# Altium schematic sheet FPGA_bank0_vss.SchDoc
size 420 x 297 mm
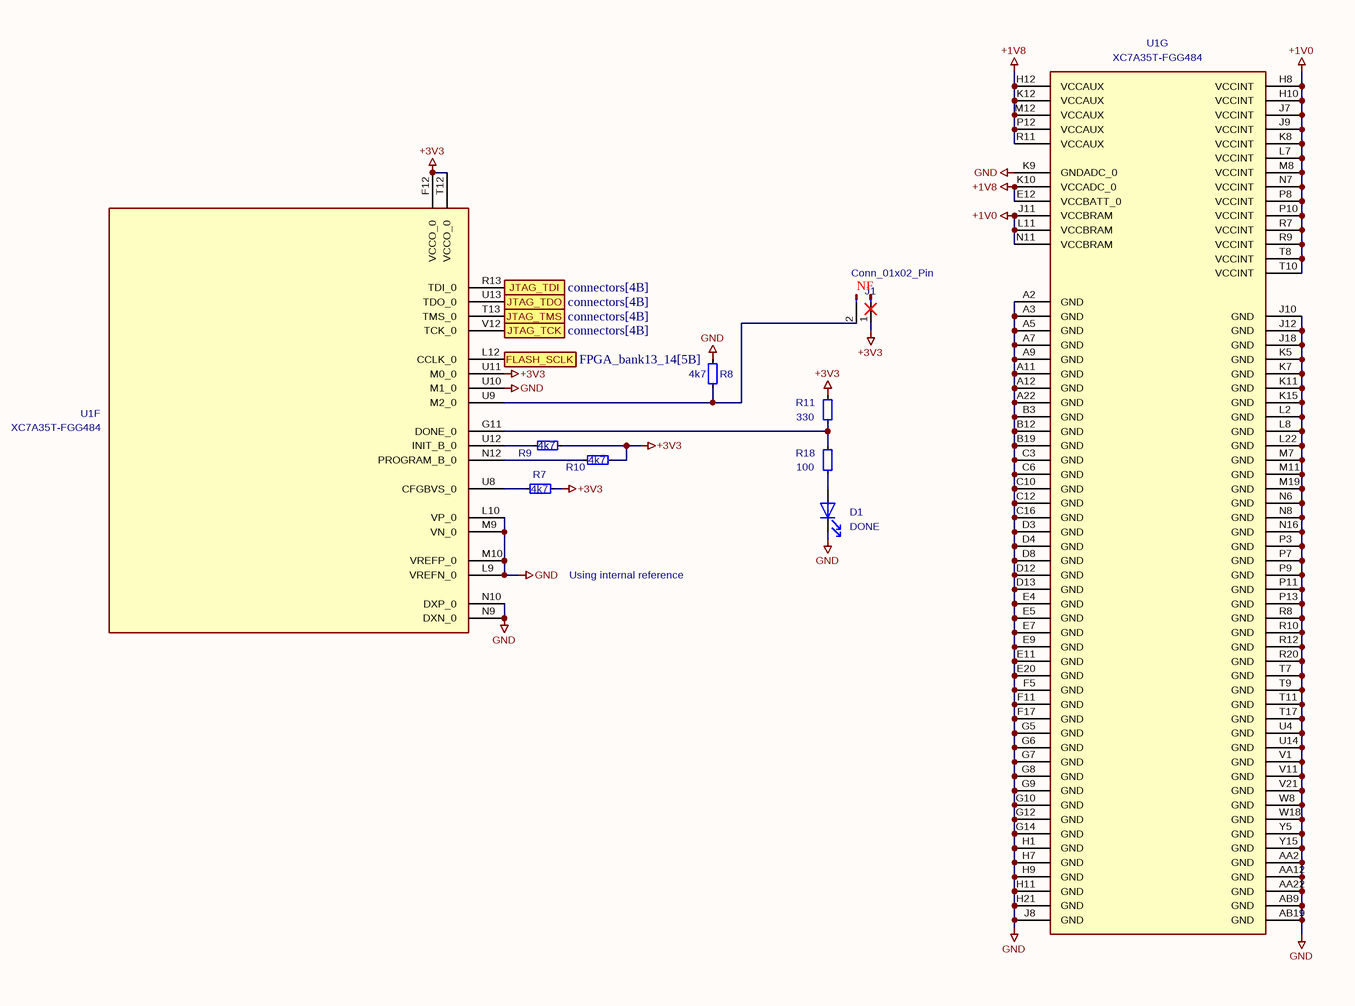
[diagram p0: FPGA_bank0_vss.SchDoc]

## Parts
D1  DONE  [LED_0603_1608Metric]
J1  Conn_01x02_Pin  [PinHeader_1x02_P2.54mm_Vertical]  (no BOM)
R7  4k7  [R_0402_1005Metric]
R8  4k7  [R_0402_1005Metric]
R9  4k7  [R_0402_1005Metric]
R10  4k7  [R_0402_1005Metric]
R11  330  [R_0402_1005Metric]
R18  100  [R_0402_1005Metric]
U1  XC7A35T-FGG484  [FB-BGA-484_23.0x23.0mm_Layout22x22_P1.0mm]  (parts F,G of 7)

## Ports
FLASH_SCLK (out, see FPGA_bank13_14[5B]), JTAG_TCK (in, see connectors[4B]), JTAG_TDI (in, see connectors[4B]), JTAG_TDO (in, see connectors[4B]), JTAG_TMS (in, see connectors[4B])

## Nets
+1V0: U1.H8(VCCINT) U1.H10(VCCINT) U1.J7(VCCINT) U1.J9(VCCINT) U1.J11(VCCBRAM) U1.K8(VCCINT) U1.L7(VCCINT) U1.L11(VCCBRAM) U1.M8(VCCINT) U1.N7(VCCINT) U1.N11(VCCBRAM) U1.P8(VCCINT) U1.P10(VCCINT) U1.R7(VCCINT) U1.R9(VCCINT) U1.T8(VCCINT) U1.T10(VCCINT)
+1V8: U1.E12(VCCBATT_0) U1.H12(VCCAUX) U1.K10(VCCADC_0) U1.K12(VCCAUX) U1.M12(VCCAUX) U1.P12(VCCAUX) U1.R11(VCCAUX)
+3V3: J1.1(Pin_1) R7.2 R9.2 R10.2 R11.2 U1.F12(VCCO_0) U1.T12(VCCO_0) U1.U11(M0_0)
GND: D1.1(K) R8.2 U1.A2(GND) U1.A3(GND) U1.A5(GND) U1.A7(GND) U1.A9(GND) U1.A11(GND) U1.A12(GND) U1.A22(GND) U1.AA2(GND) U1.AA12(GND) U1.AA22(GND) U1.AB9(GND) U1.AB19(GND) U1.B3(GND) U1.B12(GND) U1.B19(GND) U1.C3(GND) U1.C6(GND) U1.C10(GND) U1.C12(GND) U1.C16(GND) U1.D3(GND) U1.D4(GND) U1.D8(GND) U1.D12(GND) U1.D13(GND) U1.E4(GND) U1.E5(GND) U1.E7(GND) U1.E9(GND) U1.E11(GND) U1.E20(GND) U1.F5(GND) U1.F11(GND) U1.F17(GND) U1.G5(GND) U1.G6(GND) U1.G7(GND) U1.G8(GND) U1.G9(GND) U1.G10(GND) U1.G12(GND) U1.G14(GND) U1.H1(GND) U1.H7(GND) U1.H9(GND) U1.H11(GND) U1.H21(GND) U1.J8(GND) U1.J10(GND) U1.J12(GND) U1.J18(GND) U1.K5(GND) U1.K7(GND) U1.K9(GNDADC_0) U1.K11(GND) U1.K15(GND) U1.L2(GND) U1.L8(GND) U1.L9(VREFN_0) U1.L10(VP_0) U1.L22(GND) U1.M7(GND) U1.M9(VN_0) U1.M10(VREFP_0) U1.M11(GND) U1.M19(GND) U1.N6(GND) U1.N8(GND) U1.N9(DXN_0) U1.N10(DXP_0) U1.N16(GND) U1.P3(GND) U1.P7(GND) U1.P9(GND) U1.P11(GND) U1.P13(GND) U1.R8(GND) U1.R10(GND) U1.R12(GND) U1.R20(GND) U1.T7(GND) U1.T9(GND) U1.T11(GND) U1.T17(GND) U1.U4(GND) U1.U10(M1_0) U1.U14(GND) U1.V1(GND) U1.V11(GND) U1.V21(GND) U1.W8(GND) U1.W18(GND) U1.Y5(GND) U1.Y15(GND)
FLASH_SCLK: U1.L12(CCLK_0) ; port FLASH_SCLK
JTAG_TCK: U1.V12(TCK_0) ; port JTAG_TCK
JTAG_TDI: U1.R13(TDI_0) ; port JTAG_TDI
JTAG_TDO: U1.U13(TDO_0) ; port JTAG_TDO
JTAG_TMS: U1.T13(TMS_0) ; port JTAG_TMS
NetD1_2: D1.2(A) R18.1
NetJ1_2: J1.2(Pin_2) R8.1 U1.U9(M2_0)
NetR7_1: R7.1 U1.U8(CFGBVS_0)
NetR9_1: R9.1 U1.U12(INIT_B_0)
NetR10_1: R10.1 U1.N12(PROGRAM_B_0)
NetR11_1: R11.1 R18.2 U1.G11(DONE_0)

## Notes on the sheet
- (near J1) NF
- Using internal reference
- 1
- 2
- 3
- 4
- 5
- 6
- 7
- 8
- A
- B
- C
- D
- E
- Title: FPGA SOM 1
- File: FPGA_bank0_vss.kicad_sch
- Sheet: /
- controlpaths.com <http://controlpaths.com>
- F
- KiCad E.D.A.  kicad (5.1.4)-1
- Size: A3
- Date:
- Rev: B
- Id: 1/1

## Library data of the parts
D1 = LED: JLCPCB: C89814; Value: DONE; Footprint: LED_SMD:LED_0603_1608Metric
R7-R11 R18 = R_Small: Footprint: Resistor_SMD:R_0402_1005Metric
  R7-R10: JLCPCB: C3017492; Value: 4k7
  R11: JLCPCB: C881192; Value: 330
  R18: JLCPCB: C471762; Value: 100
J1 = Conn_01x02_Pin: Value: Conn_01x02_Pin; Footprint: Connector_PinHeader_2.54mm:PinHeader_1x02_P2.54mm_Vertical
U1 = XC7A35T-FGG484: Value: XC7A35T-FGG484; Footprint: Package_BGA:FB-BGA-484_23.0x23.0mm_Layout22x22_P1.0mm